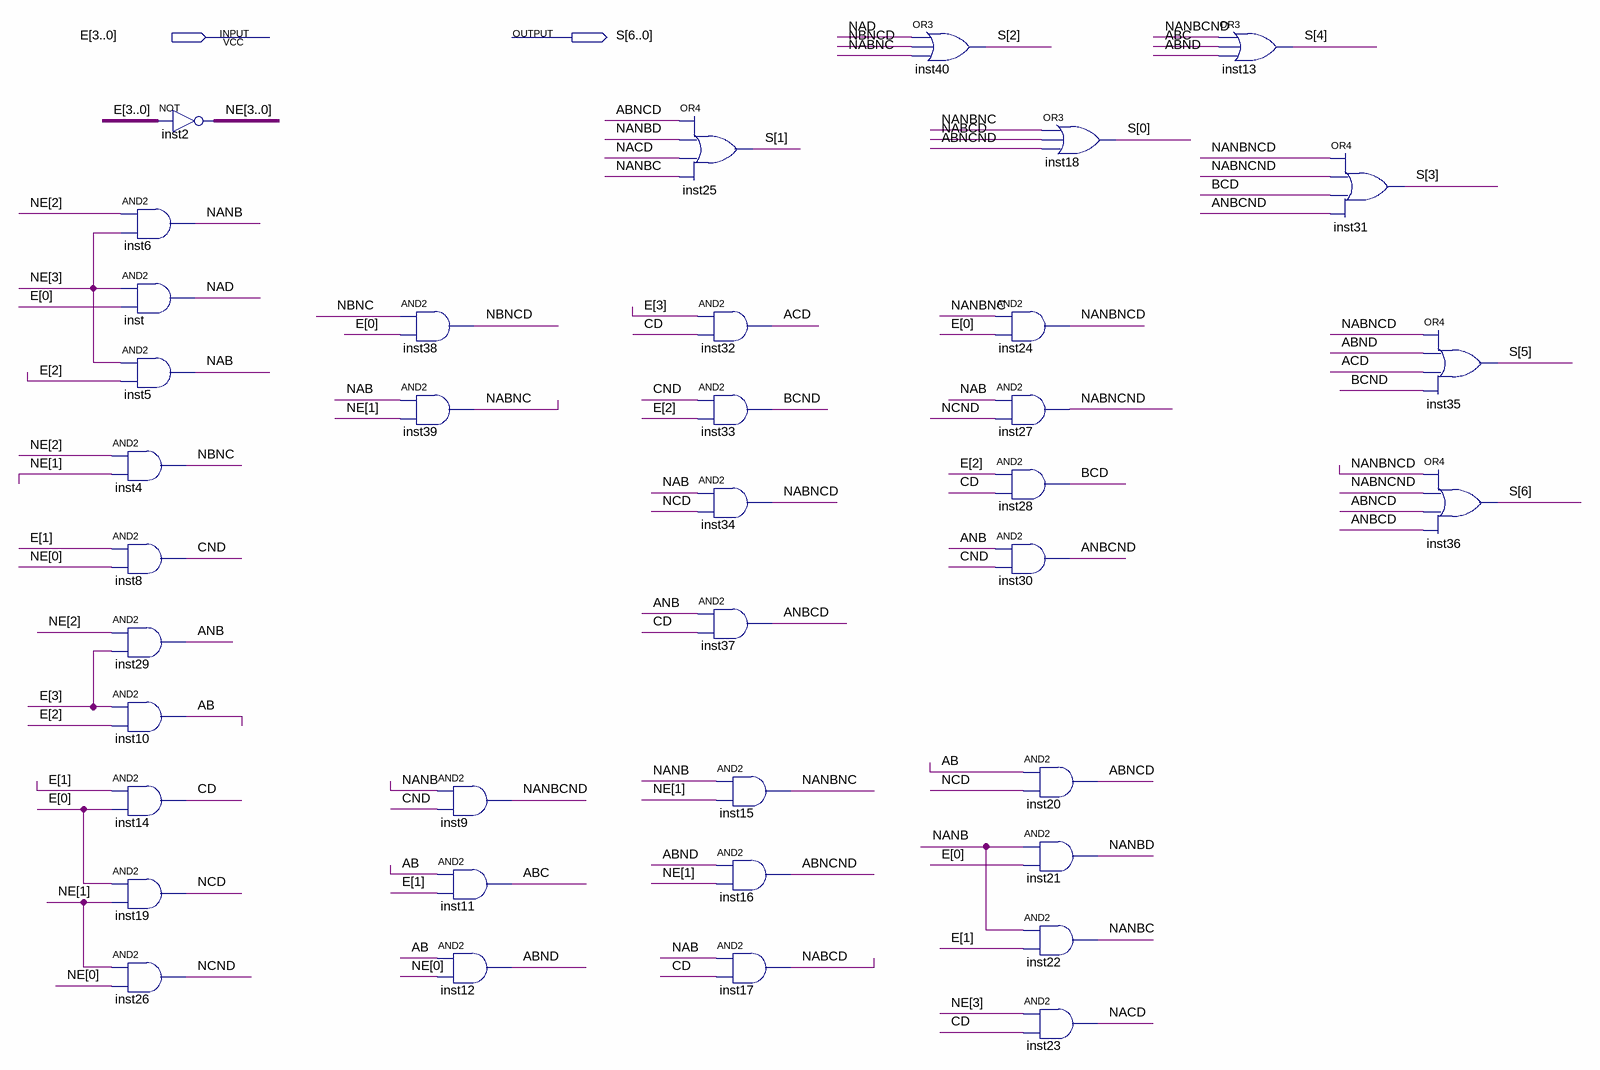
[diagram p0: schematic sheet]
// Quartus schematic conversor.bdf as structural Verilog: 38 symbols, 2 pins
module conversor (
  input  [3:0] E,
  output [6:0] S
);

  wire AB, ABC, ABNCD, ABNCND, ABND, ACD, ANB, ANBCD, ANBCND, BCD, BCND, CD, CND, NAB, NABCD, NABNC, NABNCD,
       NABNCND, NACD, NAD, NANB, NANBC, NANBCND, NANBD, NANBNC, NANBNCD, NBNC, NBNCD, NCD, NCND;
  wire [3:0] NE;

  and inst6 (NANB, NE[2], NE[3]);
  and inst (NAD, NE[3], E[0]);
  and inst5 (NAB, NE[3], E[2]);
  and inst4 (NBNC, NE[2], NE[1]);
  and inst8 (CND, E[1], NE[0]);
  and inst29 (ANB, NE[2], E[3]);
  and inst10 (AB, E[3], E[2]);
  and inst14 (CD, E[1], E[0]);
  and inst19 (NCD, E[0], NE[1]);
  and inst26 (NCND, NE[1], NE[0]);
  assign NE = ~E;  // NOT inst2, 4 bits wide
  and inst38 (NBNCD, NBNC, E[0]);
  and inst39 (NABNC, NAB, NE[1]);
  and inst9 (NANBCND, NANB, CND);
  and inst11 (ABC, AB, E[1]);
  and inst12 (ABND, AB, NE[0]);
  or inst25 (S[1], ABNCD, NANBD, NACD, NANBC);
  and inst32 (ACD, E[3], CD);
  and inst33 (BCND, CND, E[2]);
  and inst34 (NABNCD, NAB, NCD);
  and inst37 (ANBCD, ANB, CD);
  and inst15 (NANBNC, NANB, NE[1]);
  and inst16 (ABNCND, ABND, NE[1]);
  and inst17 (NABCD, NAB, CD);
  or inst40 (S[2], NAD, NBNCD, NABNC);
  and inst24 (NANBNCD, NANBNC, E[0]);
  and inst27 (NABNCND, NAB, NCND);
  and inst28 (BCD, E[2], CD);
  and inst30 (ANBCND, ANB, CND);
  and inst20 (ABNCD, AB, NCD);
  and inst21 (NANBD, NANB, E[0]);
  and inst22 (NANBC, NANB, E[1]);
  and inst23 (NACD, NE[3], CD);
  or inst18 (S[0], NANBNC, NABCD, ABNCND);
  or inst13 (S[4], NANBCND, ABC, ABND);
  or inst31 (S[3], NANBNCD, NABNCND, BCD, ANBCND);
  or inst35 (S[5], NABNCD, ABND, ACD, BCND);
  or inst36 (S[6], NANBNCD, NABNCND, ABNCD, ANBCD);
endmodule
